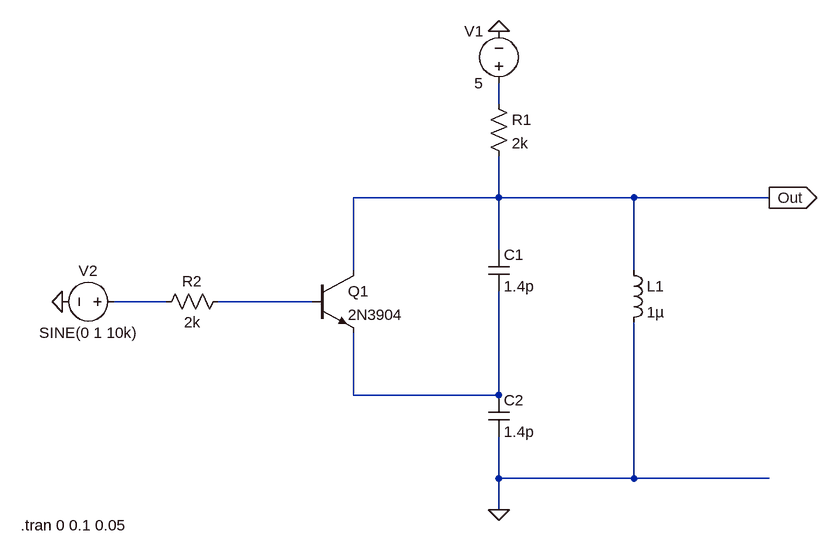
[diagram p0: schematic EE430_Project1V2.asc]
EE430_Project1V2.asc, the LTspice schematic file:
Version 4
SHEET 1 964 680
WIRE 448 -272 448 -304
WIRE 448 -128 448 -192
WIRE 448 -128 224 -128
WIRE 656 -128 448 -128
WIRE 864 -128 656 -128
WIRE 448 -48 448 -128
WIRE 224 -16 224 -128
WIRE 656 -16 656 -128
WIRE -64 32 -144 32
WIRE 160 32 16 32
WIRE 224 176 224 80
WIRE 448 176 448 16
WIRE 448 176 224 176
WIRE 448 304 448 240
WIRE 656 304 656 64
WIRE 656 304 448 304
WIRE 864 304 656 304
WIRE 448 352 448 304
FLAG 448 352 0
FLAG 448 -384 0
FLAG -224 32 0
FLAG 864 -128 Out
IOPIN 864 -128 Out
SYMBOL npn 160 -16 R0
SYMATTR InstName Q1
SYMATTR Value 2N3904
SYMBOL ind 640 -32 R0
SYMATTR InstName L1
SYMATTR Value 1µ
SYMBOL cap 432 -48 R0
SYMATTR InstName C1
SYMATTR Value 1.4p
SYMBOL cap 432 176 R0
SYMATTR InstName C2
SYMATTR Value 1.4p
SYMBOL voltage 448 -288 R180
WINDOW 0 24 96 Left 2
WINDOW 3 24 16 Left 2
WINDOW 123 0 0 Left 0
WINDOW 39 0 0 Left 0
SYMATTR InstName V1
SYMATTR Value 5
SYMBOL voltage -128 32 R90
WINDOW 0 -32 56 VBottom 2
WINDOW 3 32 56 VTop 2
WINDOW 123 0 0 Left 0
WINDOW 39 0 0 Left 0
SYMATTR InstName V2
SYMATTR Value SINE(0 1 10k)
SYMBOL res 432 -288 R0
SYMATTR InstName R1
SYMATTR Value 2k
SYMBOL res 32 16 R90
WINDOW 0 0 56 VBottom 2
WINDOW 3 32 56 VTop 2
SYMATTR InstName R2
SYMATTR Value 2k
TEXT -288 376 Left 2 !.tran 0 0.1 0.05

The netlist it stands for:
* EE430_Project1V2.asc
Q1 Out N003 N004 0 2N3904
L1 Out 0 1µ
C1 Out N004 1.4p
C2 N004 0 1.4p
V1 N001 0 5
V2 N002 0 SINE(0 1 10k)
R1 N001 Out 2k
R2 N003 N002 2k
.model NPN NPN
.model PNP PNP
.lib standard.bjt
.tran 0 0.1 0.05
.backanno
.end